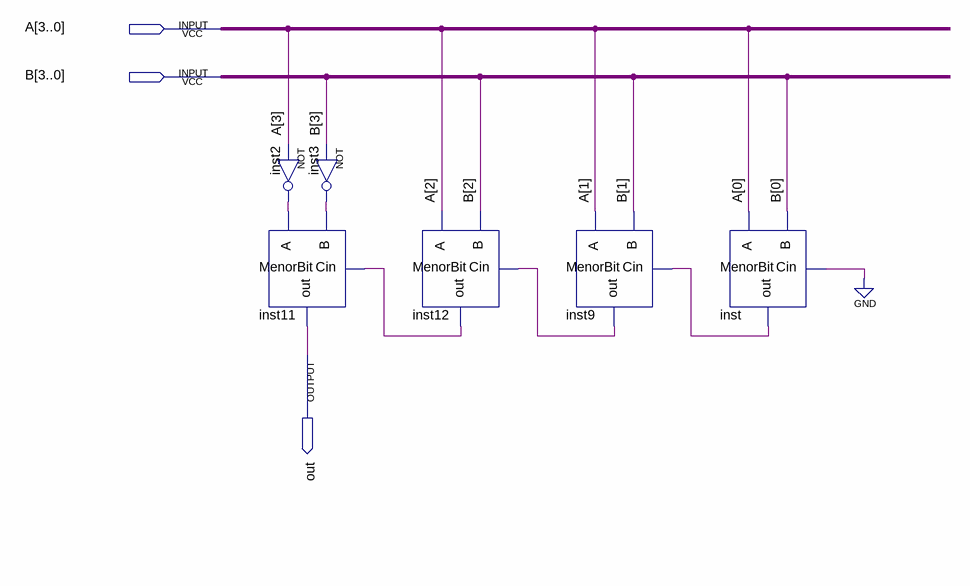
[diagram p0: schematic sheet]
// Quartus schematic Menor.bdf as structural Verilog: 6 symbols, 3 pins
module Menor (
  input  [3:0] A,
  input  [3:0] B,
  output out
);

  wire inst2_out, inst3_out, inst9_out, inst12_out, inst_out;

  not inst2 (inst2_out, A[3]);
  MenorBit inst11 (.B(inst3_out), .A(inst2_out), .Cin(inst12_out), .out(out));
  not inst3 (inst3_out, B[3]);
  MenorBit inst12 (.B(B[2]), .A(A[2]), .Cin(inst9_out), .out(inst12_out));
  MenorBit inst9 (.B(B[1]), .A(A[1]), .Cin(inst_out), .out(inst9_out));
  MenorBit inst (.B(B[0]), .A(A[0]), .Cin(1'b0), .out(inst_out));
endmodule
